# Altium project EDR.PrjPcb
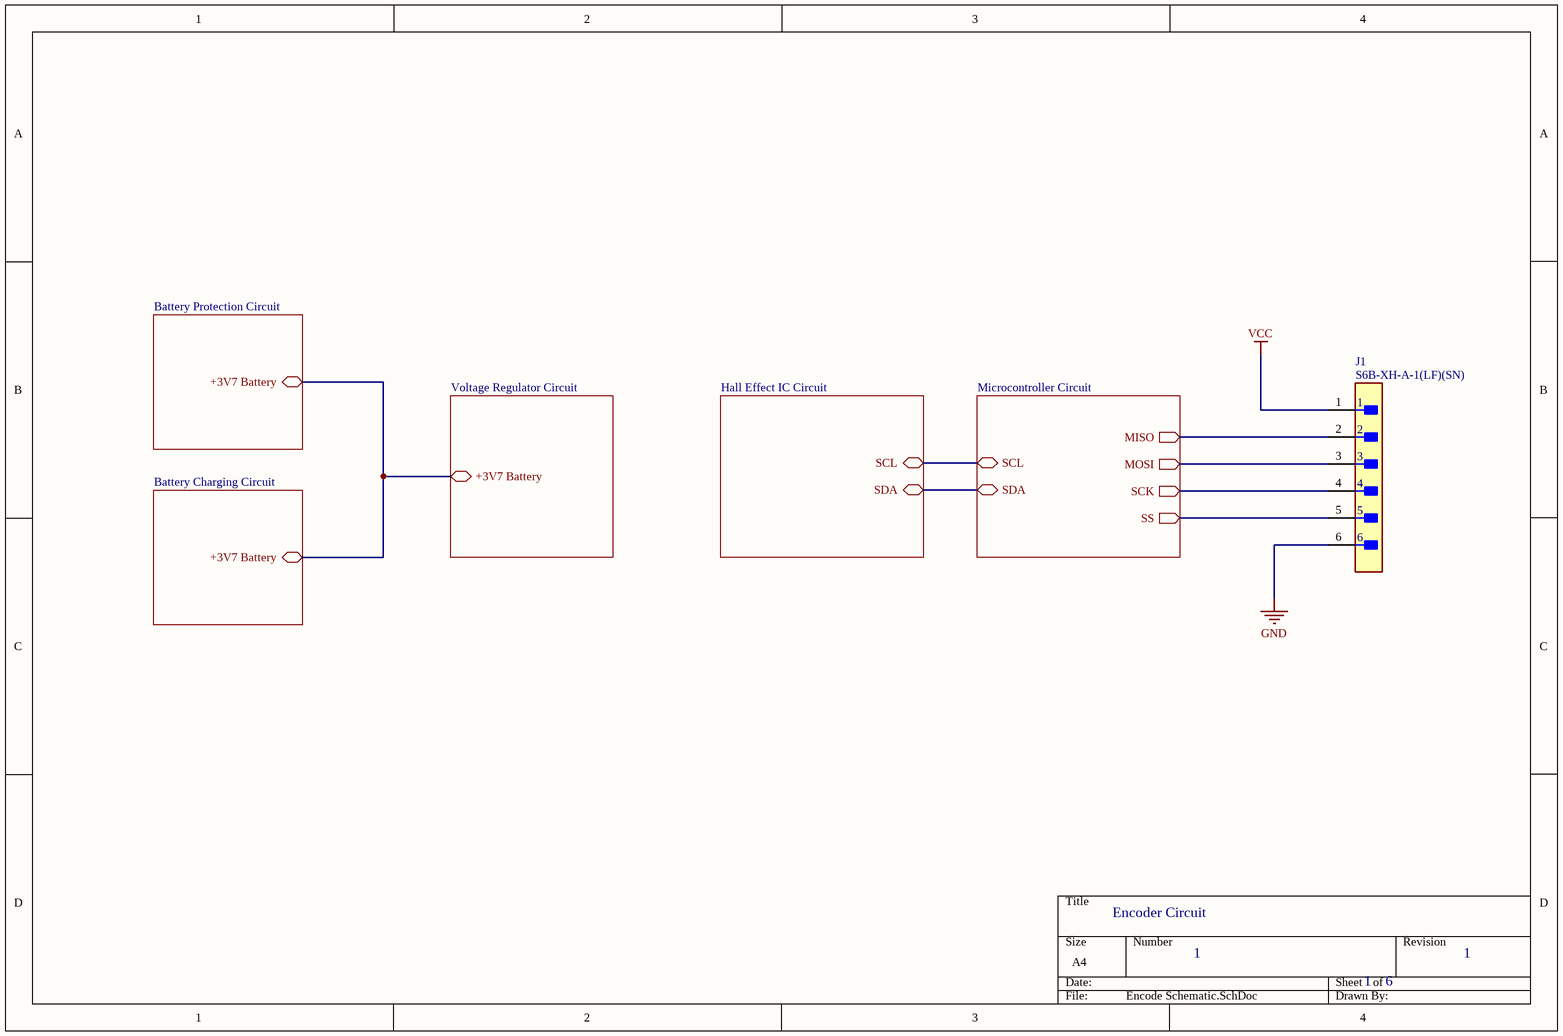
[diagram p0: Encode Schematic.SchDoc]
6 sheets, 39 parts. Net scope: hierarchical (ports join the sheet entries above them; power ports are global).
Board file: PCB1.PcbDoc
Sheets:
  Encode Schematic.SchDoc
    Microcontroller Circuit = Microcontroller.SchDoc
    Hall Effect IC Circuit = Hall Effect IC.SchDoc
    Battery Charging Circuit = Battery Charger.SchDoc
    Battery Protection Circuit = Battery Protection.SchDoc
    Voltage Regulator Circuit = Voltage Regulator.SchDoc

## Sheet Encode Schematic.SchDoc
size A4; SheetNumber: 1; SheetTotal: 6

### Parts
J1  S6B-XH-A-1(LF)(SN)  [FP-S6B-XH-A-1_LF_SN-MFG]

### Sub-sheets
Battery Charging Circuit = Battery Charger.SchDoc: +3V7 Battery (bidir)
Battery Protection Circuit = Battery Protection.SchDoc: +3V7 Battery (bidir)
Hall Effect IC Circuit = Hall Effect IC.SchDoc: SCL (bidir), SDA (bidir)
Microcontroller Circuit = Microcontroller.SchDoc: MOSI (out), MISO (out), SCK (out), SS (out), SCL (bidir), SDA (bidir)
Voltage Regulator Circuit = Voltage Regulator.SchDoc: +3V7 Battery (bidir)

### Nets
GND: J1.6
VCC: J1.1
+3V7 Battery: sheet Battery Charging Circuit/+3V7 Battery, sheet Battery Protection Circuit/+3V7 Battery, sheet Voltage Regulator Circuit/+3V7 Battery
MISO: J1.2 ; sheet Microcontroller Circuit/MISO
MOSI: J1.3 ; sheet Microcontroller Circuit/MOSI
SCK: J1.4 ; sheet Microcontroller Circuit/SCK
SS: J1.5 ; sheet Microcontroller Circuit/SS
NetIC1_6: sheet Microcontroller Circuit/SDA, sheet Hall Effect IC Circuit/SDA
NetIC1_7: sheet Microcontroller Circuit/SCL, sheet Hall Effect IC Circuit/SCL

### Notes on the sheet
- Encoder Circuit
- 1
- 6

### Library data of the parts
J1 = CMP-17439-000023-1: CONN HEADER R/A P6OS 2.5MM; Voltage Rating: 250V; Insulation Resistance: 1GR; Current Rating: 3A; Number of Positions: 6; Gender: Male; Mount: Through Hole; Material: Polyamide; Max Operating Temperature: 85°C; Contact Plating: Tin; Number of Rows: 1; Color: Natural; Termination: Crimp; Min Operating Temperature: -25°C; Pitch: 2.5mm; Lead Free: Lead Free; Contact Material: Brass

## Sheet Microcontroller.SchDoc
size A4; SheetNumber: 2; SheetTotal: 6
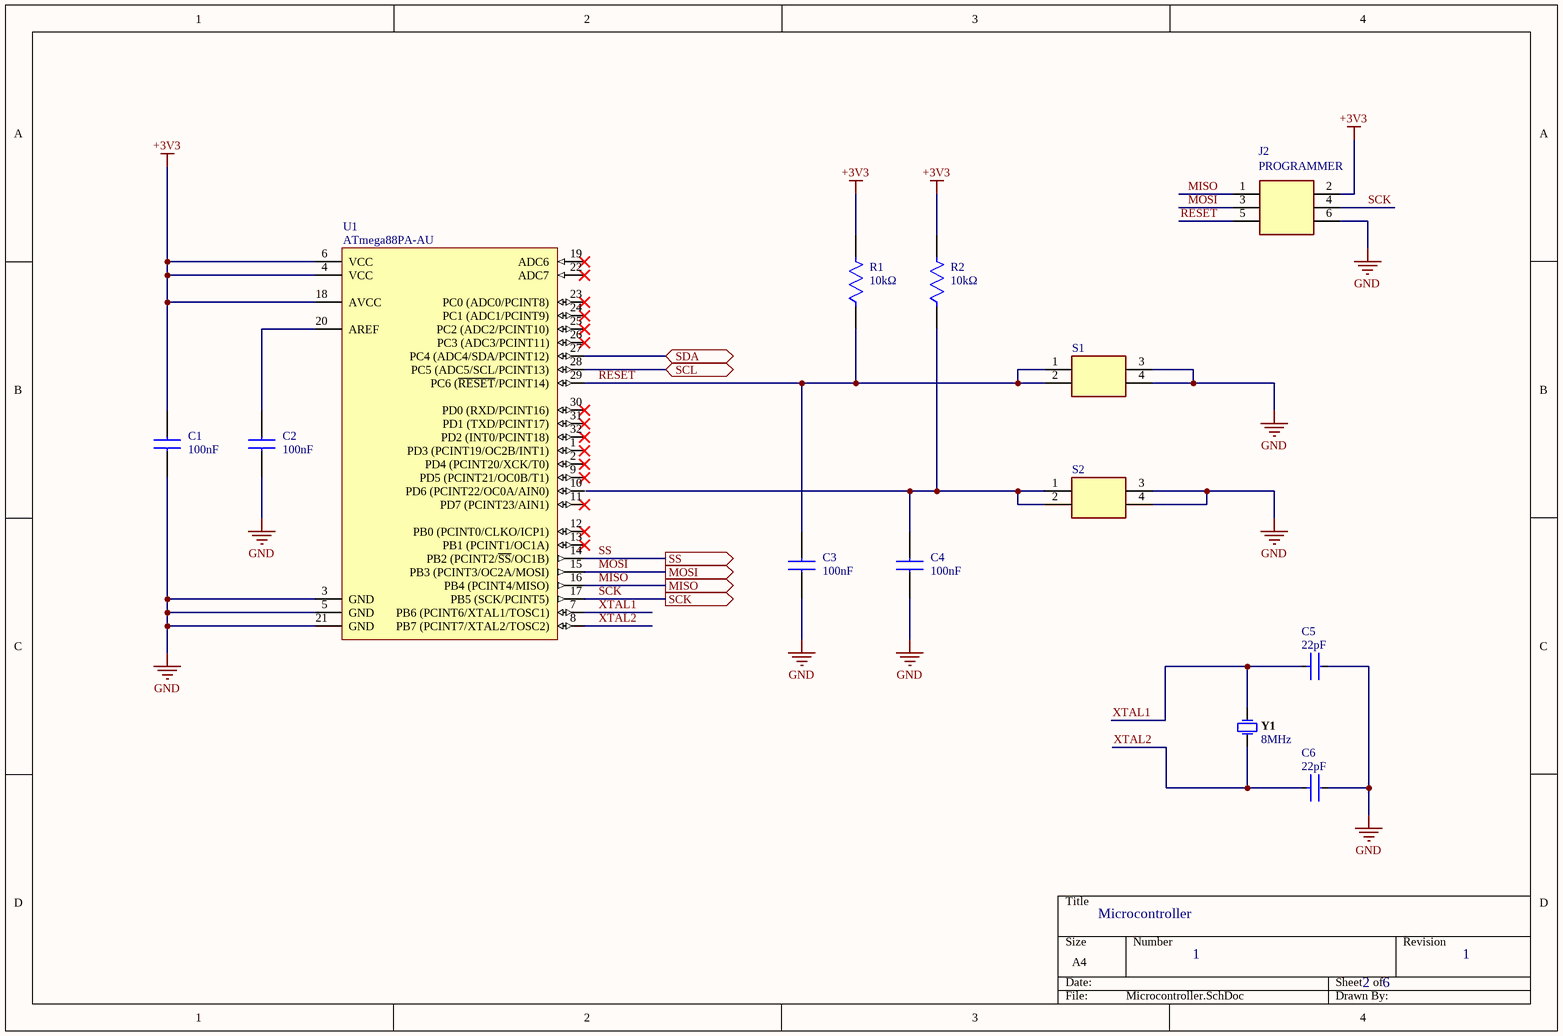
[diagram p1: Microcontroller.SchDoc]

### Parts
C1  value 100nF  [CAPC2013X137N]  (hidden comment: 0805B104K500NT)
C2  value 100nF  [CAPC2013X137N]  (hidden comment: 0805B104K500NT)
C3  value 100nF  [CAPC2013X137N]  (hidden comment: 0805B104K500NT)
C4  value 100nF  [CAPC2013X137N]  (hidden comment: 0805B104K500NT)
C5  Capacitance: 22pF  [FP-0805-L_2_01_0_2-W_1_25-IPC_A]  (hidden comment: 08051A220K4T2A)
C6  Capacitance: 22pF  [FP-0805-L_2_01_0_2-W_1_25-IPC_A]  (hidden comment: 08051A220K4T2A)
J2  Name: PROGRAMMER  [HDRV6W90P254_2X3_762X500X560P]  (hidden comment: 90131-0763)
R1  value 10kΩ  [FP-CR0805-IPC_A]  (hidden comment: CR0805-FX-1002ELF)
R2  value 10kΩ  [FP-CR0805-IPC_A]  (hidden comment: CR0805-FX-1002ELF)
S1  1301.9315.24  [13019319]  (value not drawn)
S2  1301.9315.24  [13019319]  (value not drawn)
U1  ATmega88PA-AU  [32A_L]
Y1  value 8MHz  [FOX-FOXSLF080-20]  (hidden comment: FOXSLF/080-20)

### Ports
MISO (out, see Encode Schematic[4B]), MOSI (out, see Encode Schematic[4B]), SCK (out, see Encode Schematic[4B]), SCL (bidir, see Encode Schematic[3B], Hall Effect IC[3B]), SDA (bidir, see Encode Schematic[3B], Hall Effect IC[3B]), SS (out, see Encode Schematic[4C])

### Nets
+3V3: C1.1 J2.2 R1.2 R2.2 U1.4(VCC) U1.6(VCC) U1.18(AVCC)
GND: C1.2 C2.2 C3.2 C4.2 C5.2 C6.2 J2.6 S1.3(COM_1) S1.4(COM_2) S2.3(COM_1) S2.4(COM_2) U1.3(GND) U1.5(GND) U1.21(GND)
MISO: J2.1 U1.16(PB4_(PCINT4/MISO)) ; port MISO
MOSI: J2.3 U1.15(PB3_(PCINT3/OC2A/MOSI)) ; port MOSI
RESET: C3.1 J2.5 R1.1 S1.1(NO_1) S1.2(NO_2) U1.29(PC6_(~{RESET}/PCINT14))
SCK: J2.4 U1.17(PB5_(SCK/PCINT5)) ; port SCK
SS: U1.14(PB2_(PCINT2/~{SS}/OC1B)) ; port SS
XTAL1: C5.1 U1.7(PB6_(PCINT6/XTAL1/TOSC1)) Y1.2
XTAL2: C6.1 U1.8(PB7_(PCINT7/XTAL2/TOSC2)) Y1.1
NetC2_1: C2.1 U1.20(AREF)
NetC4_1: C4.1 R2.1 S2.1(NO_1) S2.2(NO_2)
NetIC1_6: U1.27(PC4_(ADC4/SDA/PCINT12)) ; port SDA
NetIC1_7: U1.28(PC5_(ADC5/SCL/PCINT13)) ; port SCL

Not connected (* = marked no-connect by the designer): U1 1(PD3_(PCINT19/OC2B/INT1))* 2(PD4_(PCINT20/XCK/T0))* 9(PD5_(PCINT21/OC0B/T1))* 10(PD6_(PCINT22/OC0A/AIN0)) 11(PD7_(PCINT23/AIN1))* 12(PB0_(PCINT0/CLKO/ICP1))* 13(PB1_(PCINT1/OC1A))* 19(ADC6)* 22(ADC7)* 23(PC0_(ADC0/PCINT8))* 24(PC1_(ADC1/PCINT9))* 25(PC2_(ADC2/PCINT10))* 26(PC3_(ADC3/PCINT11))* 30(PD0_(RXD/PCINT16))* 31(PD1_(TXD/PCINT17))* 32(PD2_(INT0/PCINT18))*

### Notes on the sheet
- Microcontroller
- 1
- 2
- 6

### Library data of the parts
C1-C4 = 0805B104K500NT: Capacitor; Manufacturer_Name: Novacap; Datasheet Link: https://componentsearchengine.com/Datasheets/1/0805B104K500NT.pdf; Height: 1.37mm; Manufacturer_Part_Number: 0805B104K500NT; Mouser Part Number: 767-0805B104K500NT; Mouser Price/Stock: https://www.mouser.com/Search/Refine.aspx?Keyword=767-0805B104K500NT
C5 C6 = CMP-04427-002582-1: Automotive Ceramic Capacitor, 0805, 22pF, 10%, C0G, 30ppm/°C, 100V; Termination: SMD/SMT; Ratings: AEC-Q200; Construction: Flat; Packaging: Tape and Reel; Mount: Surface Mount; Case Code (Imperial): 0805; Radiation Hardening: No; Tolerance: 10%; Width: 1.2mm; Case/Package: 0805; Thickness: 0.037inch; Min Operating Temperature: -55°C; Dielectric: C0G; Voltage Rating: 100V; Series: -; Package Quantity: 4000; Depth: 1.25mm; Max Operating Temperature: 125°C; Voltage Rating (DC): 100V; Case Code (Metric): 2012; Number of Pins: 2; Length: 2.01mm; RoHS Compliant: Yes
J2 = 90131-0763: Connector; Manufacturer_Name: Molex; Datasheet Link: https://www.molex.com/pdm_docs/sd/901310763_sd.pdf; Height: 5.6mm; Manufacturer_Part_Number: 90131-0763; Mouser Part Number: 538-90131-0763; Mouser Price/Stock: https://www.mouser.co.uk/ProductDetail/Molex/90131-0763?qs=KObwnG1V4zuKPiIchrbqlw%3D%3D
R1 R2 = CMP-07231-003204-1: Thick Film Chip Resistors 0805 10kΩ 0.125W 1% 100ppm/°C; Max Power Dissipation: 125mW; Voltage Rating: 150V; Voltage Rating (DC): 100V; Resistance: 10kR; Height: 0.5mm; Tolerance: 1%; Max Operating Temperature: 155°C; Thickness: 508um; Radiation Hardening: No; Packaging: Tape and Reel; Depth: 1.25mm; Contact Plating: Tin; Package Quantity: 1; Case Code (Metric): 2012; REACH SVHC: No SVHC; Min Operating Temperature: -55°C; Power Rating: 125mW; Mount: Surface Mount; Length: 2mm; Case Code (Imperial): 0805; Width: 1.25mm; Temperature Coefficient: 100ppm/°C; Termination: SMD/SMT; Composition: Thick Film; Features: Moisture Resistant; Case/Package: 0805; Number of Terminations: 2
S1 S2 = 1301.9315.24: Switch; Manufacturer_Name: SCHURTER; Datasheet Link: https://www.schurter.com/en/datasheet/typ_6x6_mm_tact_switches.pdf; Height: 9mm; Manufacturer_Part_Number: 1301.9315.24; Mouser Part Number: 693-1301.9315.24; Mouser Price/Stock: https://www.mouser.co.uk/ProductDetail/Schurter/1301.9315.24?qs=wYWahoWfBn9TJM14ZGQ%2Fug%3D%3D; Arrow Part Number: 1301.9315.24; Arrow Price/Stock: https://www.arrow.com/en/products/1301.9315.24/schurter?region=europe
U1 = CMP-0095-00213-2: 8-bit AVR Microcontroller, 8KB Flash, 512 Bytes EEPROM, 1KB SRAM, 32-pin TQFP, Industrial Grade (-40°C to 85°C); PackageReference: 32A; PackageDescription: 32-Lead, 7x7x1.0 mm Body, 0.8mm Lead Pitch, Thin Profile Plastic Quad Flat Package (TQFP); ComponentLink2Description: ATmega48A/48PA/88A/88PA/168A/168PA/328/328P Datasheet; ComponentLink3URL: http://www.atmel.com/dyn/resources/prod_documents/8271S.pdf; ComponentLink3Description: ATmega48A/48PA/88A/88PA/168A/168PA/328/328P Summary; PackageVersion: revC, Oct-2010; RevisionNote: DatasheetVersion & PackageVersion updated. URLs added.; DatasheetVersion: revD, May-2011; ComponentLink1URL: http://www.atmel.com/; ComponentLink2URL: http://www.atmel.com/dyn/resources/prod_documents/doc8271.pdf; Code_JEDEC: MS-026-ABA; ComponentLink1Description: Manufacturer URL
Y1 = CMP-1749-00002-1: Resistance Weld Thru-Hole Crystal, 8 MHz, -20 to 70 degC, 2-Pin THD, RoHS, Bulk; Dropout Voltage: 2 V; Outputs: 1; Nominal Output Voltage: 5 V; Min Input Voltage: 7 V; Case\Package: TO-263-3; Max Input Voltage: 35 V; Max Ouput Current: 1 A; Length: 10.24 mm; Max Operating Temperature: 125 degC; Mount: Surface Mount; PackageDescription: 2-Pin Through Hole Device, Body 11.35 x 4.65 mm; Package Quantity: 50; Pins: 3; ComponentLink2URL: http://download.siliconexpert.com/pdfs/2015/4/5/6/5/7/200/fox_/manual/35607121449963728hc49slf.pdf; PackageReference: FOXSLF080-20; Min Operating Temperature: 0 degC; Height: 30.02 mm; Packaging: Rail/Tube; Radiation Hardening: No; Width: 9.35 mm; ComponentLink1URL: http://www.foxonline.com/; DatasheetVersion: Mar-15; ComponentLink1Description: Manufacturer URL; Output Voltage: 5 V; RoHSCompliant: true; REACH SVHC: No SVHC; Output Current: 1 A; ComponentLink2Description: Datasheet

## Sheet Hall Effect IC.SchDoc
size A4; SheetNumber: 3; SheetTotal: 6
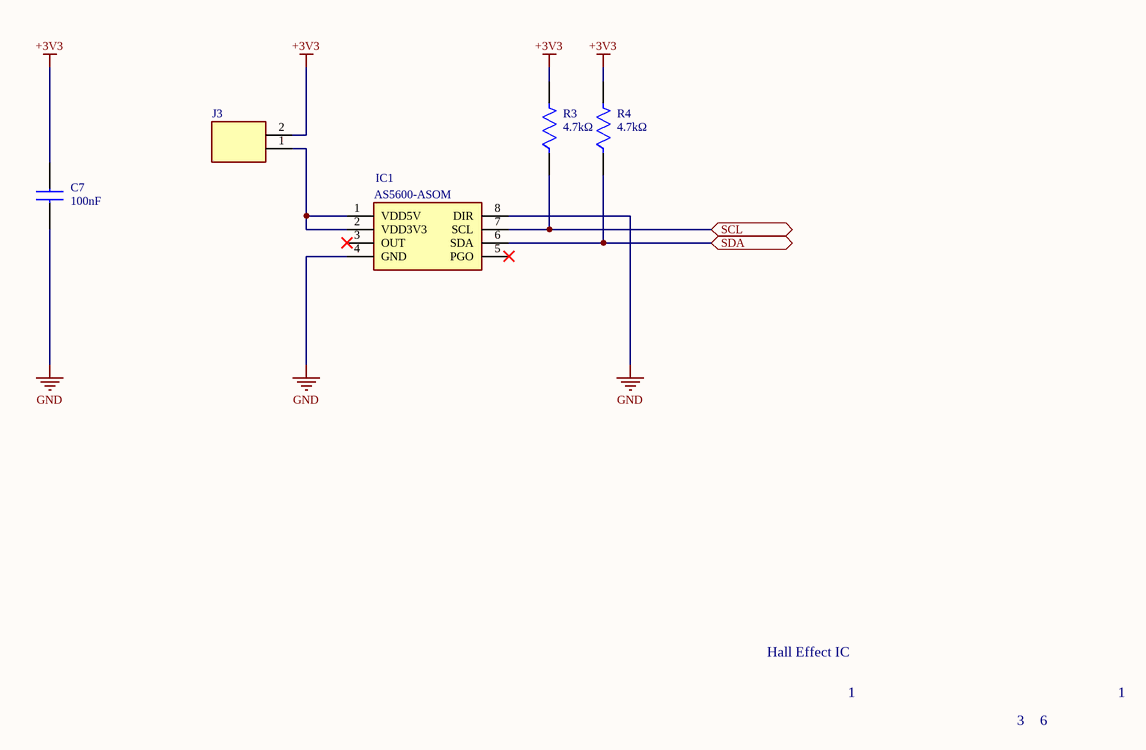
[diagram p2: Hall Effect IC.SchDoc]

### Parts
C7  value 100nF  [CAPC2013X137N]  (hidden comment: 0805B104K500NT)
IC1  AS5600-ASOM  [SOIC127P600X175-8N]
J3  87527-2  [HDRV2W66P0X254_1X2_467X244X1044P]  (value not drawn)
R3  value 4.7kΩ  [FP-RT0805-MFG]  (hidden comment: RT0805DRE074K7L)
R4  value 4.7kΩ  [FP-RT0805-MFG]  (hidden comment: RT0805DRE074K7L)

### Ports
SCL (bidir, see Encode Schematic[3B], Microcontroller[2B]), SDA (bidir, see Encode Schematic[3B], Microcontroller[2B])

### Nets
+3V3: C7.1 J3.2 R3.2 R4.2
GND: C7.2 IC1.4(GND) IC1.8(DIR)
NetIC1_1: IC1.1(VDD5V) IC1.2(VDD3V3) J3.1
NetIC1_6: IC1.6(SDA) R4.1 ; port SDA
NetIC1_7: IC1.7(SCL) R3.1 ; port SCL

Not connected (* = marked no-connect by the designer): IC1 3(OUT)* 5(PGO)*

### Notes on the sheet
- Hall Effect IC
- 1
- 3
- 6

### Library data of the parts
C7 = 0805B104K500NT: Capacitor; Manufacturer_Name: Novacap; Datasheet Link: https://componentsearchengine.com/Datasheets/1/0805B104K500NT.pdf; Height: 1.37mm; Manufacturer_Part_Number: 0805B104K500NT; Mouser Part Number: 767-0805B104K500NT; Mouser Price/Stock: https://www.mouser.com/Search/Refine.aspx?Keyword=767-0805B104K500NT
IC1 = AS5600-ASOM: Integrated Circuit; Manufacturer_Name: ams OSRAM; Datasheet Link: https://datasheet.datasheetarchive.com/originals/distributors/DKDS-11/214624.pdf; Height: 1.75mm; Manufacturer_Part_Number: AS5600-ASOM; Mouser Part Number: 985-AS5600-ASOM; Mouser Price/Stock: https://www.mouser.co.uk/ProductDetail/ams/AS5600-ASOM?qs=KTMMzrZdriG6aU1h9lJCUQ%3D%3D; Arrow Part Number: AS5600-ASOM; Arrow Price/Stock: https://www.arrow.com/en/products/as5600-asom/ams-ag?region=nac
J3 = 87527-2: Power isolation jumper; Manufacturer_Name: TE Connectivity; Datasheet Link: https://www.te.com/commerce/DocumentDelivery/DDEController?Action=showdoc&DocId=Customer+Drawing%7F87527%7FH%7Fpdf%7FEnglish%7FENG_CD_87527_H.pdf%7F87527-2; Height: 10.439mm; Manufacturer_Part_Number: 87527-2; Mouser Part Number: 571-875272; Mouser Price/Stock: https://www.mouser.co.uk/ProductDetail/TE-Connectivity/87527-2?qs=ZDXmSm13593hsB4j%252B6gMfg%3D%3D; Arrow Part Number: 87527-2; Arrow Price/Stock: https://www.arrow.com/en/products/87527-2/te-connectivity?region=nac
R3 R4 = CMP-03412-005354-1: RES SMD 4.7K OHM 0.5% 1/8W 0805; Manufacturer: Yageo; Power Rating: 0.125W; Tolerance: 0.01; Voltage Rating: 150V; Description: RT0805 4.7KΩ 0.125W 50 ppm/°C 1.00%; Temperature Coefficient: 50 ppm/°C; Lead Free: Yes; Device Class L2: Resistors; ComponentLink2Description: Datasheet; RoHS: TRUE; Package: RT0805; Resistance: 4.7KΩ; Device Class L3: Chip SMD Resistors; Ipc Land Pattern Name: RESC200125X50; Category: Res; Octopart: https://octopart.com/rt0805dre074k7l-yageo-1242027; Temperature: -55°C to +155°C; Temperature Range High: +155°C; Digikey Description: RES SMD 4.7K OHM 0.5% 1/8W 0805; Series: RT; Height: 0.6mm; Footprint Url: http://www.yageo.com/exep/pages/download/literatures/PYu-R_Mount_10.pdf; Device Class L1: Passive Components; Temperature Range Low: -55°C; Composition: Thin Film; Manufacturer Part Number: RT0805DRE074K7L; ComponentLink2URL: http://www.yageo.com/documents/recent/PYu-RT_1-to-0.01_RoHS_L_9.pdf; Automotive: No

## Sheet Battery Charger.SchDoc
size A4; SheetNumber: 6; SheetTotal: 6
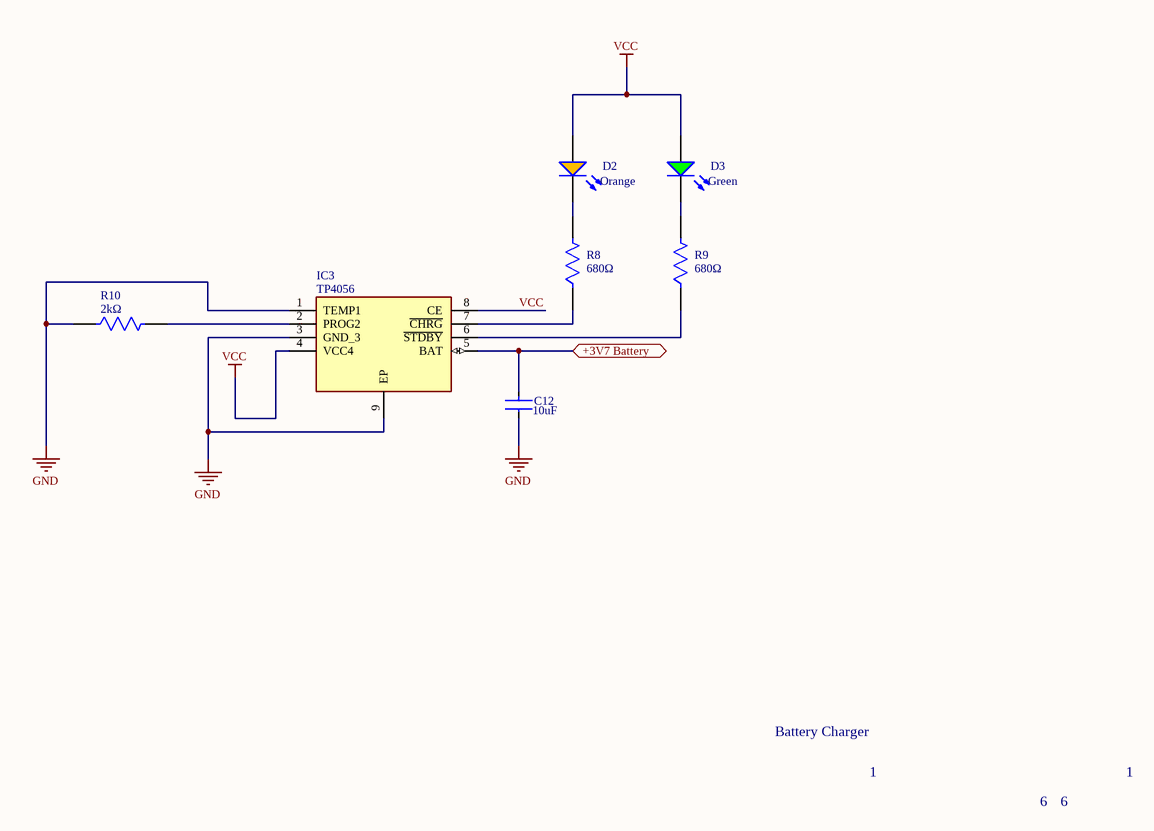
[diagram p3: Battery Charger.SchDoc]

### Parts
C12  value 10uF  [FP-GCM21B-0_2-e0_2_0_7-MFG]  (hidden comment: GCM21BC71E106KE36L)
D2  Color: Orange  [WL-SMCW_1206_150120xx75000]  (hidden comment: 150120AS75000)
D3  Color: Green  [WL-SMCW_1206_150120xx75000]  (hidden comment: 150120GS75000)
IC3  TP4056  [SOIC127P600X175-9N]
R8  value 680Ω  [FP-MCU0805-MFG]  (hidden comment: MCU08050D6800BP500)
R9  value 680Ω  [FP-MCU0805-MFG]  (hidden comment: MCU08050D6800BP500)
R10  value 2kΩ  [FP-RC2012-MFG]  (hidden comment: RC2012F202CS)

### Ports
+3V7 Battery (bidir, see Encode Schematic[1C], Battery Protection[3C], Voltage Regulator[2B])

### Nets
GND: C12.2 IC3.1(TEMP1) IC3.3(GND_3) IC3.9(EP) R10.1
VCC: D2.2(A) D3.2(A) IC3.4(VCC4) IC3.8(CE)
+3V7 Battery: C12.1 IC3.5(BAT) ; port +3V7 Battery
NetD2_1: D2.1(K) R8.2
NetD3_1: D3.1(K) R9.2
NetIC3_2: IC3.2(PROG2) R10.2
NetIC3_6: IC3.6(~{STDBY}) R9.1
NetIC3_7: IC3.7(~{CHRG}) R8.1

### Notes on the sheet
- Battery Charger
- 1
- 6

### Library data of the parts
C12 = CMP-06035-063206-1: 10 µF ±10% 25V Ceramic Capacitor X7S 0805 (2012 Metric)
D2 = CMP-1426-00018-2: NexarPartId: 29717785; Test Current: 20mA; Forward Voltage: 2V; Peak Wavelength: 610nm; Luminous Intensity: 140mcd; Dominant Wavelength: 605nm; Lens Style: Clear, Rectangular; Forward Current: 100mA; Max Reverse Voltage (DC): 5V; Viewing Angle: 140°; RoHS: Compliant; Mount: Surface Mount; Case/Package: 1206; REACH SVHC: Unknown; Packaging: Tape and Reel; Min Operating Temperature: -40°C; Length: 3.2mm; Max Operating Temperature: 85°C; Case Code (Metric): 3216; Width: 1.6mm; Case Code (Imperial): 1206; Wavelength: 605nm; Height: 680µm
D3 = CMP-1426-00014-3: NexarPartId: 29717787; Peak Wavelength: 515nm; Wavelength: 520nm; Test Current: 20mA; Dominant Wavelength: 525nm; Luminous Intensity: 450mcd; Max Junction Temperature (Tj): 95°C; Power Dissipation: 105mW; Reverse Voltage: 5V; Forward Current: 100mA; Viewing Angle: 140°; Forward Voltage: 3.2V; Lens Style: Clear, Rectangular; Width: 1.6mm; Case Code (Metric): 3216; Mount: Surface Mount; Min Operating Temperature: -40°C; Packaging: Tape and Reel; Length: 3.2mm; REACH SVHC: Unknown; Max Reverse Voltage (DC): 5V; Case/Package: 1206; Height: 680µm; Case Code (Imperial): 1206; RoHS: Compliant; Max Operating Temperature: 85°C
IC3 = TP4056: Connector; Manufacturer_Name: NanJing Top Power; Datasheet Link: https://dlnmh9ip6v2uc.cloudfront.net/datasheets/Prototyping/TP4056.pdf; Height: 1.75mm; Manufacturer_Part_Number: TP4056
R8 R9 = CMP-02407-000244-1: RES 1.05K OHM 0.5% 1/5W 0805; Temperature Coefficient: 25ppm/°C; Resistance: 680R; Tolerance: 0.1%; Max Power Dissipation: 125mW; Contact Plating: Tin; Depth: 1.25mm; Height: 0.022inch; Number of Terminations: 2; Max Operating Temperature: 125°C; Case/Package: 0805; Military Standard: Not; Packaging: Tape and Reel; Width: 0.049inch; Min Operating Temperature: -55°C; Lead Free: Lead Free; Composition: Thin Film; Length: 0.079inch; Package Quantity: 5000; Radiation Hardening: No
R10 = CMP-13261-004148-1: Res Thick Film 0805 2kΩ 1% 0.125W ±100ppm/°C Molded SMD T/R; Voltage Rating (DC): 150V; Max Power Dissipation: 125mW; Resistance: 2kR; Case/Package: 0805; Height: 0.024inch; Number of Terminations: 2; Packaging: Tape and Reel; Length: 0.079inch; Contact Plating: Tin; Temperature Coefficient: 100ppm/°C; Width: 0.049inch; Composition: Thick Film; Case Code (Imperial): 0805; Min Operating Temperature: -55°C; Case Code (Metric): 2012; Features: Moisture Resistant; Tolerance: 1%; Radiation Hardening: No; Lead Free: Lead Free; Max Operating Temperature: 155°C

## Sheet Battery Protection.SchDoc
size A4; SheetNumber: 5; SheetTotal: 6
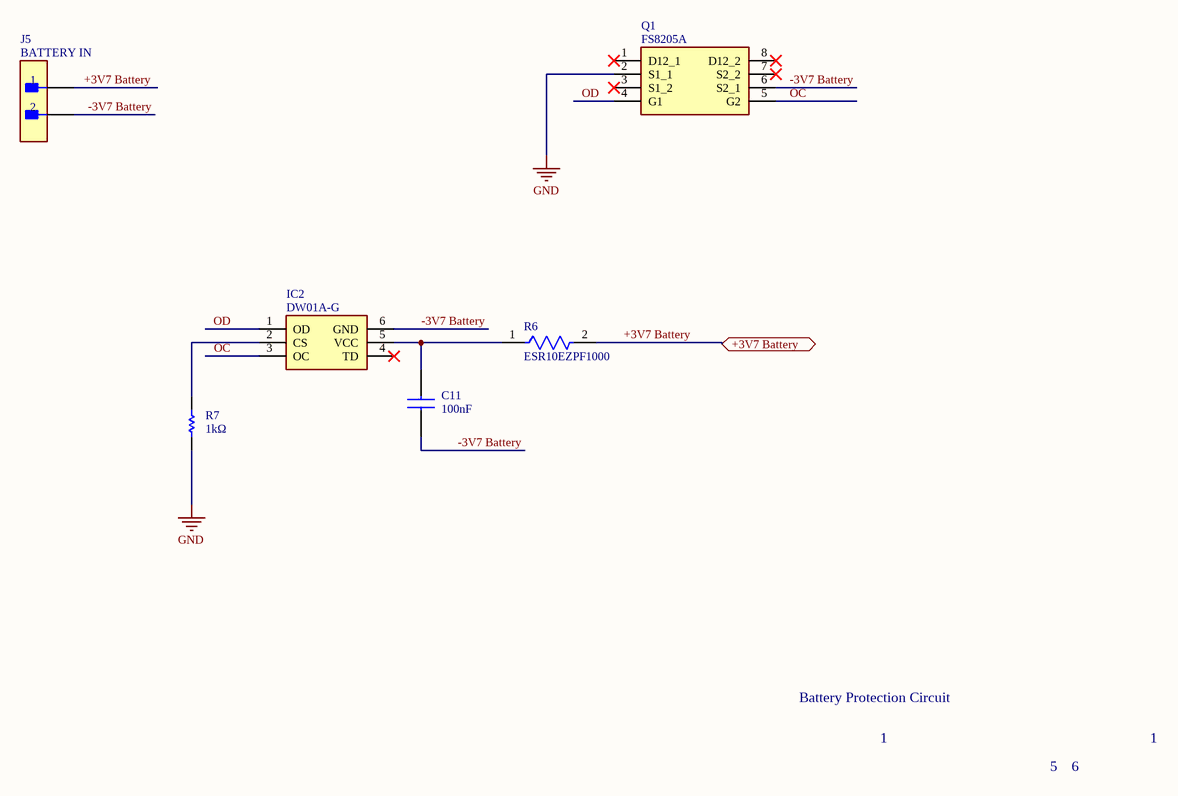
[diagram p4: Battery Protection.SchDoc]

### Parts
C11  value 100nF  [CAPC2013X137N]  (hidden comment: 0805B104K500NT)
IC2  DW01A-G  [SOT95P280X135-6N]
J5  BATTERY IN  [FP-B2B-EH-A_LF_SN-MFG]
Q1  FS8205A  [SOP65P640X120-8N]
R6  ESR10EZPF1000  [FP-ESR10-IPC_C]
R7  value 1kΩ  [RESC2013X60X30ML20T20]  (hidden comment: RK73B2ATTD102J)

### Ports
+3V7 Battery (bidir, see Encode Schematic[1B], Battery Charger[3C], Voltage Regulator[2B])

### Nets
GND: Q1.2(S1_1) R7.1
+3V7 Battery: J5.1 R6.2 ; port +3V7 Battery
-3V7 Battery: C11.2 IC2.6(GND) J5.2 Q1.6(S2_1)
OC: IC2.3(OC) Q1.5(G2)
OD: IC2.1(OD) Q1.4(G1)
NetC11_1: C11.1 IC2.5(VCC) R6.1
NetIC2_2: IC2.2(CS) R7.2

Not connected (* = marked no-connect by the designer): IC2 4(TD)*; Q1 1(D12_1)* 3(S1_2)* 7(S2_2)* 8(D12_2)*

### Notes on the sheet
- Battery Protection Circuit
- 1
- 5
- 6

### Library data of the parts
C11 = 0805B104K500NT: Capacitor; Manufacturer_Name: Novacap; Datasheet Link: https://componentsearchengine.com/Datasheets/1/0805B104K500NT.pdf; Height: 1.37mm; Manufacturer_Part_Number: 0805B104K500NT; Mouser Part Number: 767-0805B104K500NT; Mouser Price/Stock: https://www.mouser.com/Search/Refine.aspx?Keyword=767-0805B104K500NT
IC2 = DW01A-G: Integrated Circuit; Manufacturer_Name: Fortune Semiconductor Corporation; Datasheet Link: http://acoptex.com/uploads/DW01A.pdf; Height: 1.35mm; Manufacturer_Part_Number: DW01A-G
J5 = CMP-17439-000026-1: B2B-EH-A(LF)(SN), CONN HEADER VERT 2POS 2.5MM; Number of Contacts: 2; Current Rating: 3A; Connector Type: Plug; Contact Resistance: 20mR; Gender: Male; Voltage Rating: 250V; Fastening Type: Detent; Depth: 3.8mm; Max Operating Temperature: 85°C; Orientation: Straight; Series: EH; Contact Plating: Tin; Min Operating Temperature: -25°C; Contact Type: Male Pin; Housing Color: White; Termination: Press-Fit; Housing Material: Nylon; Pitch: 2.5mm; Number of Positions: 2; Max Current Rating: 3A; Packaging: Bulk; Lead Free: Lead Free; Number of Rows: 1; Length: 7.5mm; Contact Mating Length: 0.13inch; Color: Natural; Max Voltage Rating (AC): 250V; Contact Material: Copper Alloy; Mount: Through Hole
Q1 = FS8205A: MOSFET (N-Channel); Manufacturer_Name: FSC; Datasheet Link: https://datasheet.lcsc.com/szlcsc/Fortune-Semicon-FS8205A_C16052.pdf; Height: 1.2mm; Manufacturer_Part_Number: FS8205A
R6 = CMP-08839-028189-1: 100Ω ±1% 0.4W 0805 Anti-Surge Chip Resistor AEC-Q200; Resistance: 100R; Max Power Dissipation: 400mW; Temperature Coefficient: 100ppm/°C; Min Operating Temperature: -55°C; Case Code (Metric): 2012; Number of Terminations: 2; Packaging: Tape and Reel; RoHS Compliant: Yes; Max Operating Temperature: 155°C; Features: Automotive AEC-Q200; Series: ESR; Case Code (Imperial): 0805; Resistor Type: Thick Film; Tolerance: 1%; Case/Package: 0805
R7 = CMP-2001-04656-1: Manufacturer: KOA Speer; Part Number: RK73B2ATTD102J

## Sheet Voltage Regulator.SchDoc
size A4; SheetNumber: 4; SheetTotal: 6
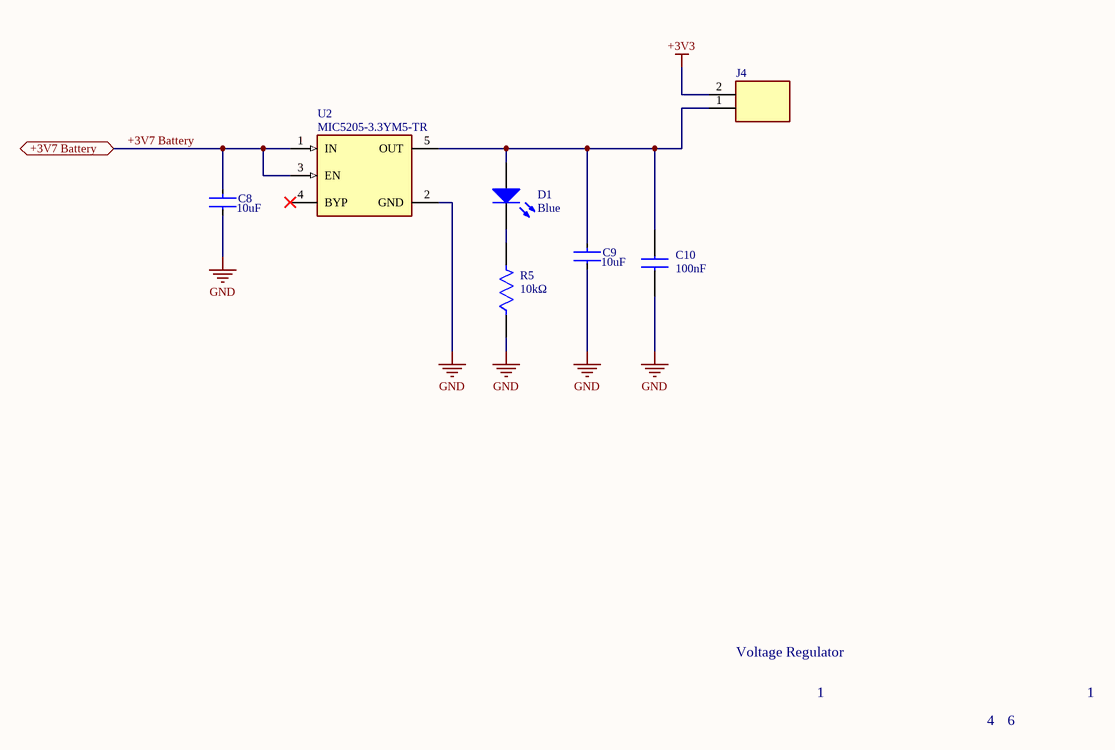
[diagram p5: Voltage Regulator.SchDoc]

### Parts
C8  value 10uF  [FP-GCM21B-0_2-e0_2_0_7-MFG]  (hidden comment: GCM21BC71E106KE36L)
C9  value 10uF  [FP-GCM21B-0_2-e0_2_0_7-MFG]  (hidden comment: GCM21BC71E106KE36L)
C10  value 100nF  [CAPC2013X137N]  (hidden comment: 0805B104K500NT)
D1  Color: Blue  [WL-SMCW_1206_150120xx75000]  (hidden comment: 150120BS75000)
J4  87527-2  [HDRV2W66P0X254_1X2_467X244X1044P]  (value not drawn)
R5  value 10kΩ  [FP-CR0805-IPC_A]  (hidden comment: CR0805-FX-1002ELF)
U2  MIC5205-3.3YM5-TR  [FP-M5-MFG]

### Ports
+3V7 Battery (bidir, see Encode Schematic[2B], Battery Charger[3C], Battery Protection[3C])

### Nets
+3V3: J4.2
GND: C8.2 C9.2 C10.2 R5.1 U2.2(GND)
+3V7 Battery: C8.1 U2.1(IN) U2.3(EN) ; port +3V7 Battery
NetC9_1: C9.1 C10.1 D1.2(A) J4.1 U2.5(OUT)
NetD1_1: D1.1(K) R5.2

Not connected (* = marked no-connect by the designer): U2 4(BYP)*

### Notes on the sheet
- Voltage Regulator
- 1
- 4
- 6

### Library data of the parts
C8 C9 = CMP-06035-063206-1: as C12 on sheet Battery Charger
C10 = 0805B104K500NT: Capacitor; Manufacturer_Name: Novacap; Datasheet Link: https://componentsearchengine.com/Datasheets/1/0805B104K500NT.pdf; Height: 1.37mm; Manufacturer_Part_Number: 0805B104K500NT; Mouser Part Number: 767-0805B104K500NT; Mouser Price/Stock: https://www.mouser.com/Search/Refine.aspx?Keyword=767-0805B104K500NT
D1 = CMP-1426-00015-2: NexarPartId: 29717786; Manufacturer Package Identifier: LED_1206; Peak Wavelength: 465nm; Dominant Wavelength: 470nm; Viewing Angle: 140°; Lens Style: Clear, Rectangular; Max Reverse Voltage (DC): 5V; Test Current: 20mA; Forward Voltage: 3.2V; Forward Current: 100mA; Luminous Intensity: 145mcd; Case Code (Metric): 3216; Case/Package: 1206; Length: 3.2mm; Packaging: Tape and Reel; Case Code (Imperial): 1206; Min Operating Temperature: -40°C; REACH SVHC: Unknown; Height: 680µm; Mount: Surface Mount; Max Operating Temperature: 85°C; RoHS: Compliant; Width: 1.6mm; Wavelength: 470nm
J4 = 87527-2: as J3 on sheet Hall Effect IC; Datasheet Link: https://www.te.com/commerce/DocumentDelivery/DDEController?Action=showdoc&DocId=Customer+Drawing%7F87527%7FH%7Fpdf%7FEnglish%7FENG_CD_87527_H.pdf%7F87527-2; Height: 10.439mm; Manufacturer_Part_Number: 87527-2; Mouser Part Number: 571-875272; Mouser Price/Stock: https://www.mouser.co.uk/ProductDetail/TE-Connectivity/87527-2?qs=ZDXmSm13593hsB4j%252B6gMfg%3D%3D; Arrow Part Number: 87527-2; Arrow Price/Stock: https://www.arrow.com/en/products/87527-2/te-connectivity?region=nac
R5 = CMP-07231-003204-1: as R1 on sheet Microcontroller; Height: 0.5mm; Tolerance: 1%; Max Operating Temperature: 155°C; Thickness: 508um; Radiation Hardening: No; Packaging: Tape and Reel; Depth: 1.25mm; Contact Plating: Tin; Package Quantity: 1; Case Code (Metric): 2012; REACH SVHC: No SVHC; Min Operating Temperature: -55°C; Power Rating: 125mW; Mount: Surface Mount; Length: 2mm; Case Code (Imperial): 0805; Width: 1.25mm; Temperature Coefficient: 100ppm/°C; Termination: SMD/SMT; Composition: Thick Film; Features: Moisture Resistant; Case/Package: 0805; Number of Terminations: 2
U2 = CMP-06324-000014-1: IC REG LINEAR 3.3V 150MA SOT23-5; Manufacturer: Microchip; Number Of Outputs: 1; Output Type: Fixed; Min Supply Voltage: 2.5V; Accuracy Percentage: 2%; Dropout Voltage: 165mV; Max Supply Voltage: 16V; Max Junction Temp: +125°C; Standoff Height: 0mm; Digikey Description: IC REG LINEAR 3.3V 150MA SOT23-5; Output Current: 150mA; Temperature: -40°C to +125°C; Temperature Range High: +125°C; Height: 1.45mm; ComponentLink2URL: http://ww1.microchip.com/downloads/en/DeviceDoc/20005785A.pdf; Mouser Description: LDO Voltage Regulators; Device Class L3: Voltage Regulators - Linear; Package: M5; Temperature Range Low: -40°C; Device Class L1: Integrated Circuits (ICs); ComponentLink2Description: Datasheet; Automotive: No; Ipc Land Pattern Name: SOT95P280X118-5; Octopart: https://octopart.com/mic5205-3.3ym5-tr-microchip-66802130; Device Class L2: Power Management ICs; Manufacturer Part Number: MIC5205-3.3YM5-TR; Lead Free: Yes; RoHS: TRUE

## Nets that join several sheets
+3V3: Microcontroller (7 pins), Hall Effect IC (C7.1 J3.2 R3.2 R4.2), Voltage Regulator (J4.2)
GND: Encode Schematic (J1.6), Microcontroller (14 pins), Hall Effect IC (C7.2 IC1.4 IC1.8), Battery Charger (5 pins), Battery Protection (Q1.2 R7.1), Voltage Regulator (5 pins)
VCC: Encode Schematic (J1.1), Battery Charger (D2.2 D3.2 IC3.4 IC3.8)
+3V7 Battery: Battery Charger (C12.1 IC3.5), Battery Protection (J5.1 R6.2), Voltage Regulator (C8.1 U2.1 U2.3)
MISO: Encode Schematic (J1.2), Microcontroller (J2.1 U1.16)
MOSI: Encode Schematic (J1.3), Microcontroller (J2.3 U1.15)
NetIC1_6: Microcontroller (U1.27), Hall Effect IC (IC1.6 R4.1)
NetIC1_7: Microcontroller (U1.28), Hall Effect IC (IC1.7 R3.1)
SCK: Encode Schematic (J1.4), Microcontroller (J2.4 U1.17)
SS: Encode Schematic (J1.5), Microcontroller (U1.14)